# EasyEDA Pro project mosfet-pcb.eprj

# Schematic Schematic1
Board Name: Board1; Create Date: 2026-01-09; Page Name: P1; Project Name: mosfet-pcb; Schematic Name: Schematic1; Update Date: 2026-02-05; Company: EasyEDA.com; Page Size: A4; Version: V1.0
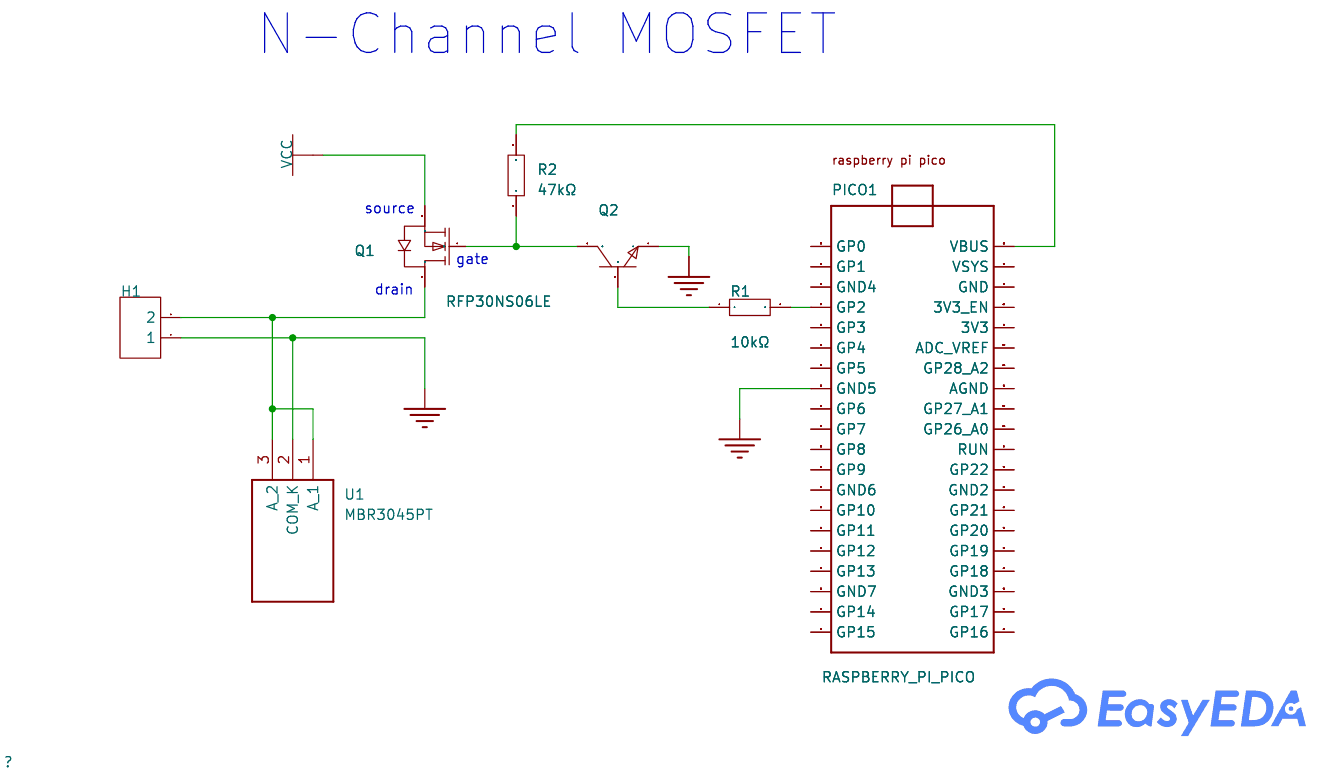
[diagram p0: schematic sheet]

## Parts
H1  -  [HDR-TH_2P-P2.54-V-F]
PICO1  RASPBERRY_PI_PICO  [RASPBERRY_PI_PICO]
Q1  RFP30NS06LE  [TO-252-2_L6.6-W6.1-P4.57-LS9.9-BR-CW]
Q2  -  [TO-92-3_L4.9-W3.7-P1.27-L]
R1  10kΩ  [R0805]
R2  47kΩ  [R0805]
U1  MBR3045PT  [TO545P505X1600X2560-3P]

## Library data of the parts
H1 = HDR-F_2.54_1x2P: Supplier Part: C49661; Supplier Footprint: 插件; Holes Structure: 1x2P; Pitch: 2.54mm; Mounting Type: Straight; Number of Rows: Plugin; Number of Holes: 2P
PICO1 = RASPBERRY_PI_PICO
Q1 = UMW30N06: Supplier Part: C369599; Manufacturer: UMW(友台半导体); Supplier Footprint: TO-252; JLCPCB Part Class: Extended Part; Datasheet: https://atta.szlcsc.com/upload/public/pdf/source/20190129/C369599_D1B2BD9C3D91B33368D5E19132E27B78.pdf; Supplier: LCSC
Q2 = 2N2222A: Transistor Type: Collector-Emitter Breakdown Voltage (Vceo): Collector Current (Ic): Power Dissipation (Pd): Collector-Emitter Saturation Voltage (VCE(sat)@Ic,Ib):1V@500mA,50mA DC Current Gain (hFE@Ic,Vce):40@500mA,10V Transition Frequency (fT):250MHz Operating Temperature:+150℃@(Tj) Operating Temperature:+150℃@(Tj); Supplier Part: C118536; Manufacturer: ST(先科); Supplier Footprint: TO-92(TO-92-3); JLCPCB Part Class: Extended Part; Datasheet: https://atta.szlcsc.com/upload/public/pdf/source/20170719/C118536_1500457734789828244.pdf; Supplier: LCSC; Collector-Emitter Saturation Voltage (VCE(sat)@Ic,Ib): 1V@500mA,50mA; DC Current Gain (hFE@Ic,Vce): 40@500mA,10V; Transition Frequency (fT): 250MHz; Operating Temperature: +150℃@(Tj)
R1 = TR0805B10K0P0525Z: Type:Thin Film Resistor Resistance: Tolerance: Power(Watts): Temperature Coefficient: Temperature Coefficient: Overload Voltage (Max): Operating Temperature Range: Operating Temperature Range:; LCSC Part Name: 10kΩ ±0.1%; Supplier Part: C188360; Manufacturer: EVER OHMS(天二科技); Supplier Footprint: 0805; JLCPCB Part Class: Extended Part; Datasheet: https://atta.szlcsc.com/upload/public/pdf/source/20190415/C188360_904785C28C4939C9C4492B7947BBF136.pdf; Supplier: LCSC; Type: Thin Film Resistor
R2 = RC0805JR-0747KL: Type:Thick Film Resistors Resistance: Tolerance: Power(Watts): Temperature Coefficient: Temperature Coefficient: Overload Voltage (Max): Operating Temperature Range: Operating Temperature Range:; LCSC Part Name: 47kΩ ±5%; Supplier Part: C131051; Manufacturer: YAGEO(国巨); Supplier Footprint: 0805; JLCPCB Part Class: Extended Part; Datasheet: https://atta.szlcsc.com/upload/public/pdf/source/20170919/C131051_1505787251677976990.pdf; Supplier: LCSC; Type: Thick Film Resistors
U1 = MBR3045PT

## Nets
GND: H1.1 PICO1.GND5 Q2.1(E) U1.2(COM_K)
VCC: Q1.3(S)
Net-(H1-2): H1.2 Q1.2(D) U1.1(A) U1.3(A_2)
Net-(PICO1-GP2): PICO1.GP2 R1.2
Net-(PICO1-VBUS): PICO1.VBUS R2.2
Net-(Q1-1): Q1.1(G) Q2.3(C) R2.1
Net-(Q2-2): Q2.2(B) R1.1

Not connected (* = marked no-connect by the designer): PICO1 3V3 3V3_EN ADC_VREF AGND GND GND2 GND3 GND4 GND6 GND7 GP0 GP1 GP3 GP4 GP5 GP6 GP7 GP8 GP9 GP10 GP11 GP12 GP13 GP14 GP15 GP16 GP17 GP18 GP19 GP20 GP21 GP22 GP26_A0 GP27_A1 GP28_A2 RUN VSYS

## Notes on the sheet
- N-Channel MOSFET
- source
- gate
- drain
